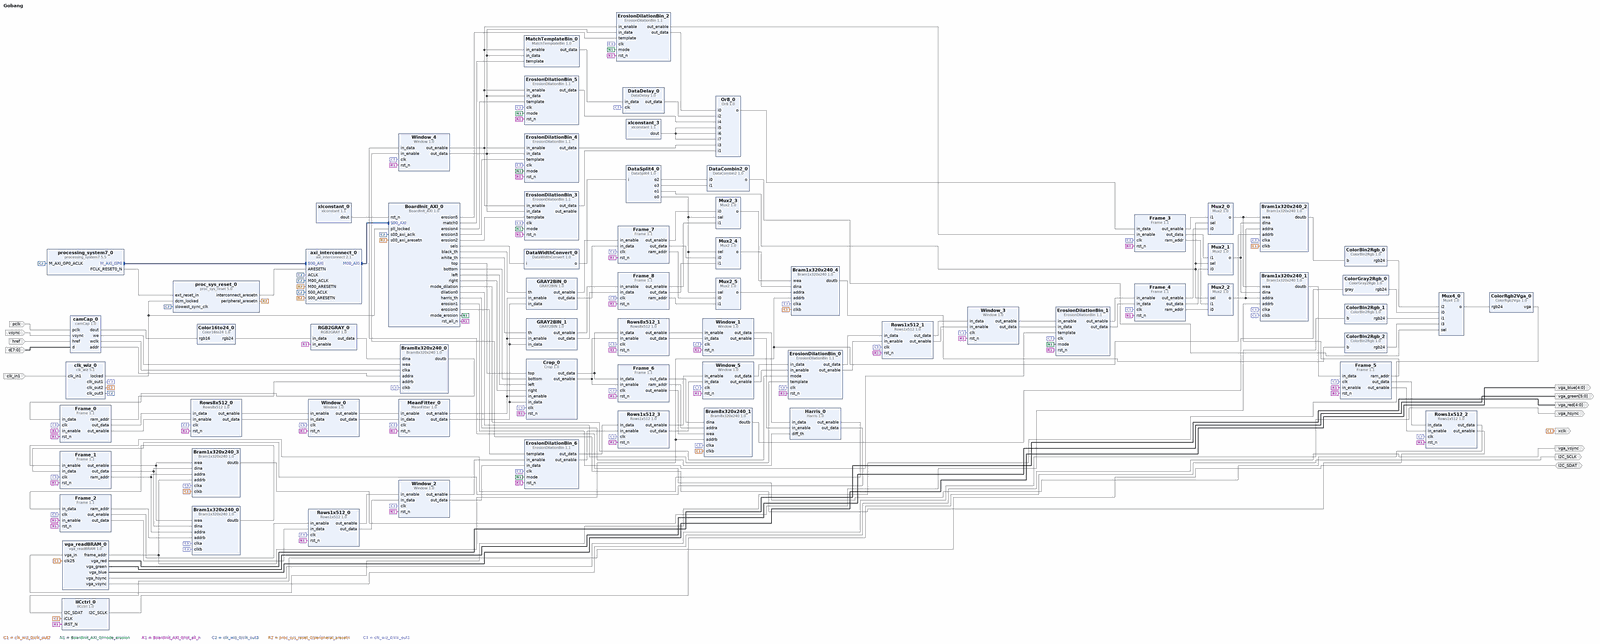
[diagram p0: block diagram of the top level, whole]
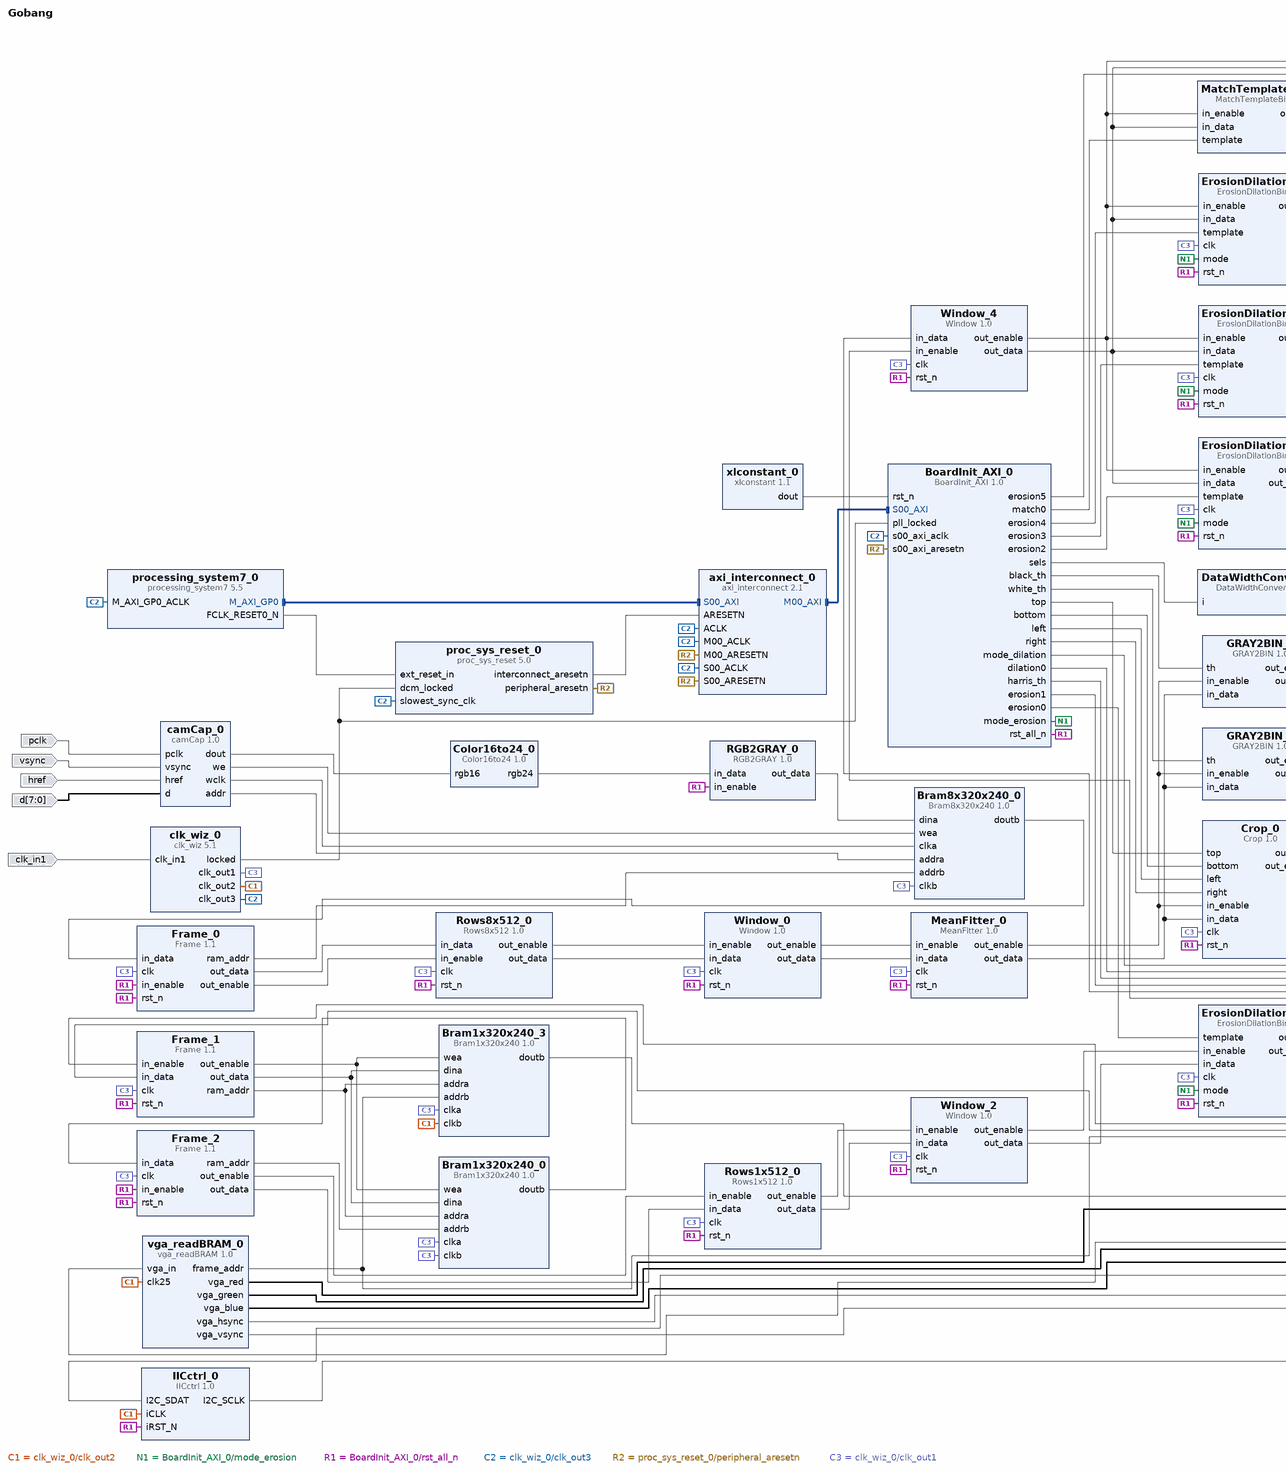
[diagram p1: block diagram of the top level, left part]
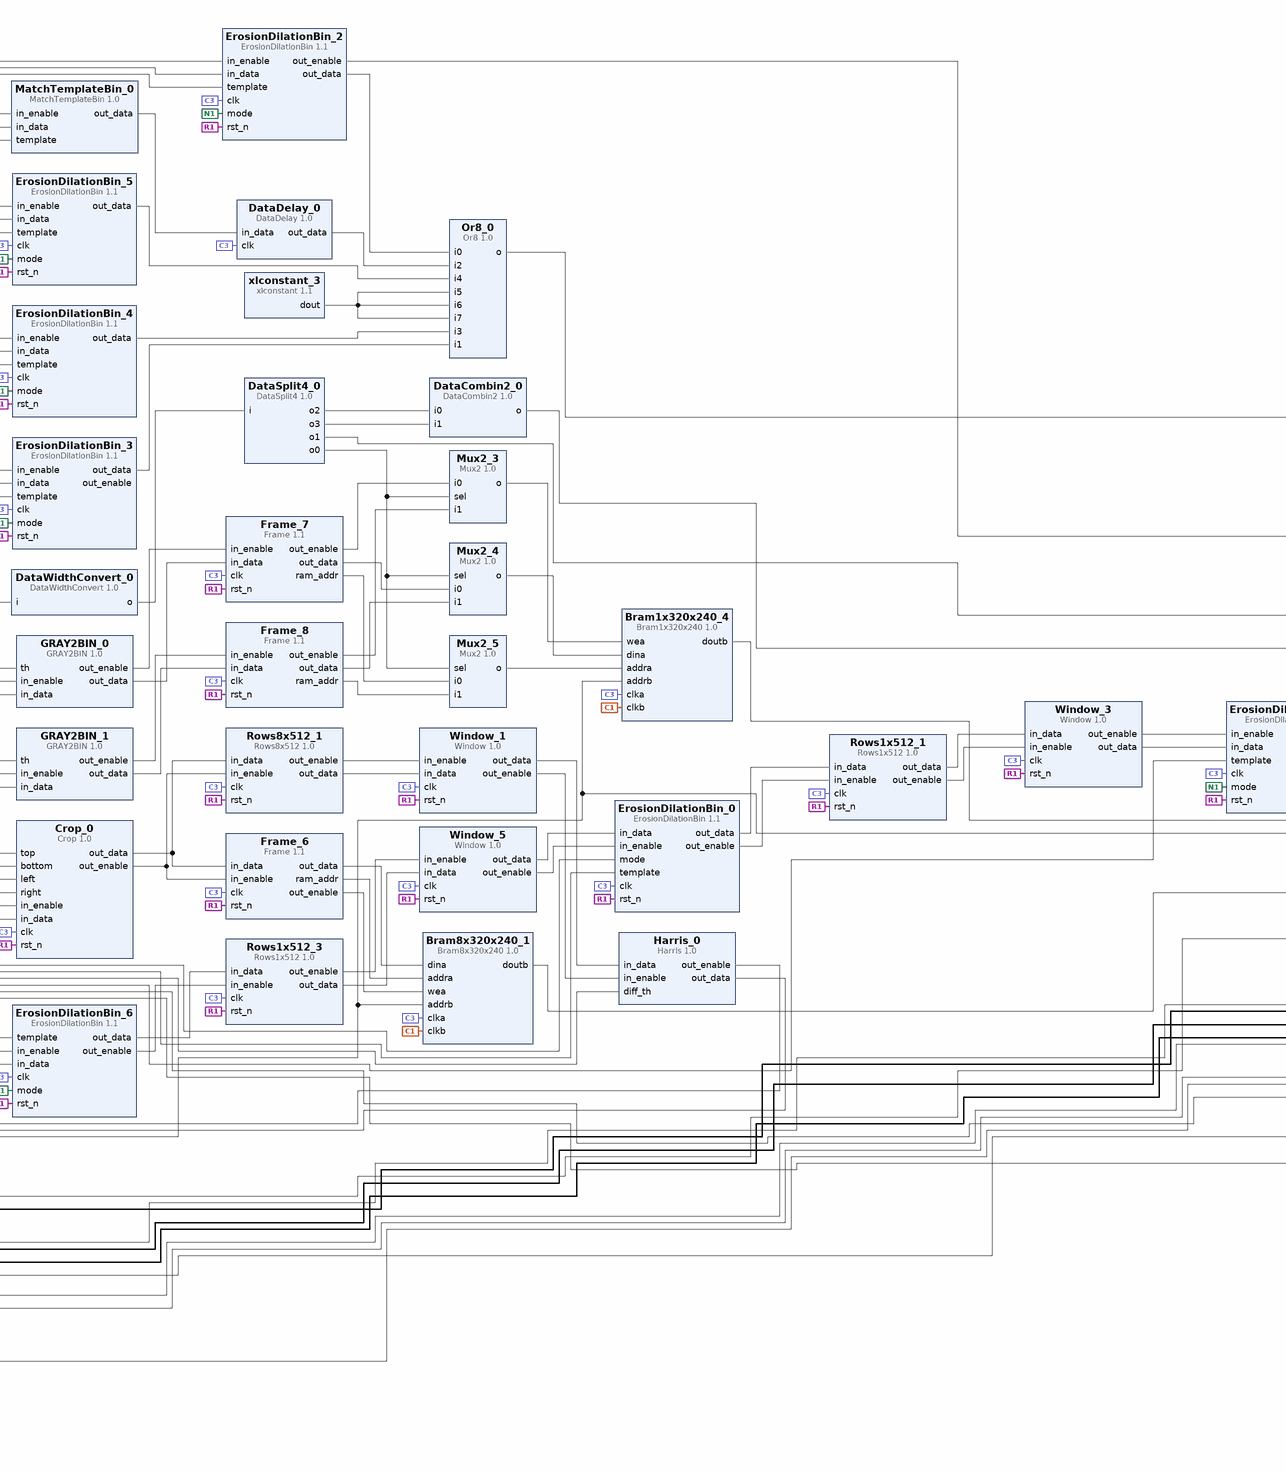
[diagram p2: block diagram of the top level, centre part]
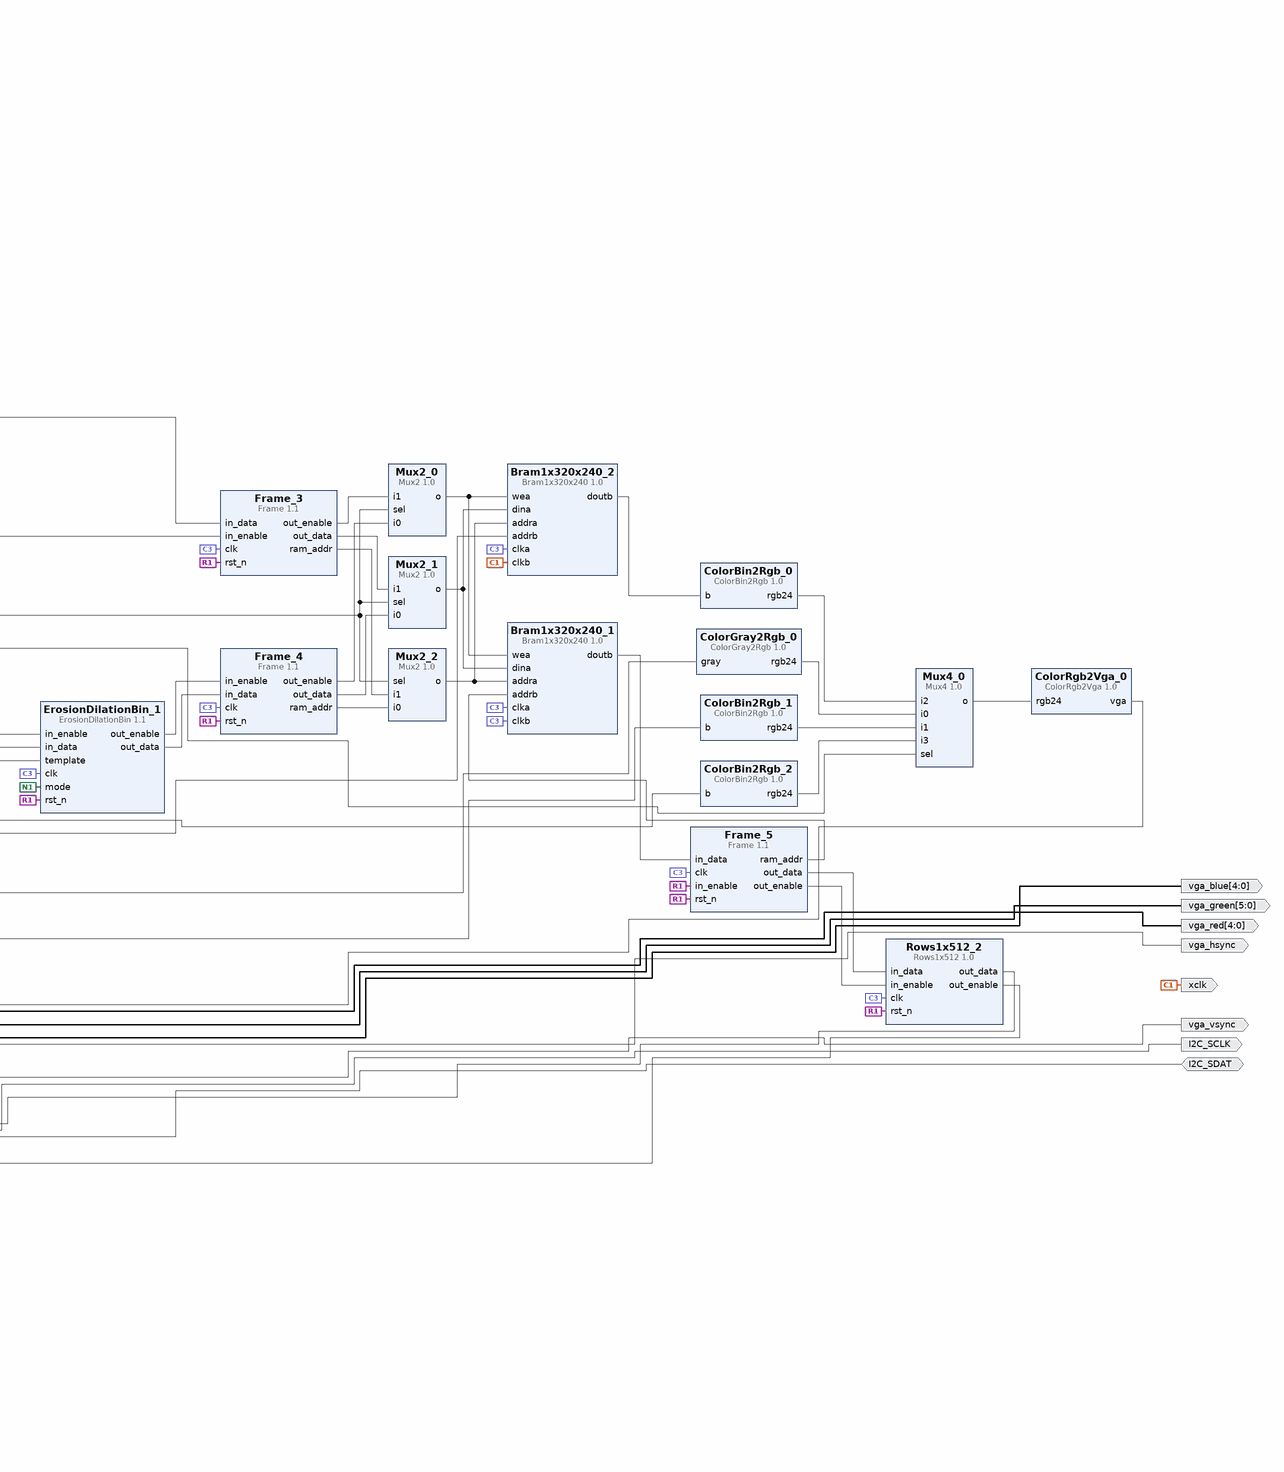
[diagram p3: block diagram of the top level, right part]
# Vivado block design Gobang, Vivado 2014.4
create_bd_design Gobang

create_bd_port -dir O xclk
create_bd_port -dir I pclk
create_bd_port -dir I vsync
create_bd_port -dir I href
create_bd_port -dir I -from 7 -to 0 d
create_bd_port -dir O -from 4 -to 0 vga_red
create_bd_port -dir O -from 5 -to 0 vga_green
create_bd_port -dir O -from 4 -to 0 vga_blue
create_bd_port -dir O vga_hsync
create_bd_port -dir O vga_vsync
create_bd_port -dir O I2C_SCLK
create_bd_port -dir IO I2C_SDAT
create_bd_port -dir I -type clk clk_in1

create_bd_cell -type ip -vlnv xilinx.com:XUP:camCap:1.0 camCap_0
create_bd_cell -type ip -vlnv dtysky:Image:Color16to24:1.0 Color16to24_0
create_bd_cell -type ip -vlnv dtysky:Image:RGB2GRAY:1.0 RGB2GRAY_0
create_bd_cell -type ip -vlnv dtysky:Image:Harris:1.0 Harris_0
create_bd_cell -type ip -vlnv dtysky:Image:MatchTemplateBin:1.0 MatchTemplateBin_0
create_bd_cell -type ip -vlnv xilinx.com:ip:xlconstant:1.1 xlconstant_3
set_property -dict {CONFIG.CONST_VAL 0} [get_bd_cells xlconstant_3]
create_bd_cell -type ip -vlnv dtysky:user:Or8:1.0 Or8_0
create_bd_cell -type ip -vlnv dtysky:Image:ColorBin2Rgb:1.0 ColorBin2Rgb_0
create_bd_cell -type ip -vlnv dtysky:user:Mux2:1.0 Mux2_0
set_property -dict {CONFIG.data_width 1} [get_bd_cells Mux2_0]
create_bd_cell -type ip -vlnv dtysky:user:Mux2:1.0 Mux2_1
set_property -dict {CONFIG.data_width 1} [get_bd_cells Mux2_1]
create_bd_cell -type ip -vlnv dtysky:user:Mux2:1.0 Mux2_2
set_property -dict {CONFIG.data_width 17} [get_bd_cells Mux2_2]
create_bd_cell -type ip -vlnv dtysky:Image:DataDelay:1.0 DataDelay_0
set_property -dict {CONFIG.data_width 1} [get_bd_cells DataDelay_0]
create_bd_cell -type ip -vlnv dtysky:Image:ErosionDilationBin:1.1 ErosionDilationBin_0
set_property -dict {CONFIG.window_size 5 CONFIG.pip_counter 4} [get_bd_cells ErosionDilationBin_0]
create_bd_cell -type ip -vlnv dtysky:Image:ErosionDilationBin:1.1 ErosionDilationBin_1
set_property -dict {CONFIG.window_size 5} [get_bd_cells ErosionDilationBin_1]
create_bd_cell -type ip -vlnv dtysky:Image:ErosionDilationBin:1.1 ErosionDilationBin_2
set_property -dict {CONFIG.window_size 3 CONFIG.pip_counter 3} [get_bd_cells ErosionDilationBin_2]
create_bd_cell -type ip -vlnv dtysky:Image:ErosionDilationBin:1.1 ErosionDilationBin_3
set_property -dict {CONFIG.window_size 3 CONFIG.pip_counter 3} [get_bd_cells ErosionDilationBin_3]
create_bd_cell -type ip -vlnv dtysky:Image:ErosionDilationBin:1.1 ErosionDilationBin_4
set_property -dict {CONFIG.window_size 3 CONFIG.pip_counter 3} [get_bd_cells ErosionDilationBin_4]
create_bd_cell -type ip -vlnv dtysky:Image:ErosionDilationBin:1.1 ErosionDilationBin_5
set_property -dict {CONFIG.window_size 3 CONFIG.pip_counter 3} [get_bd_cells ErosionDilationBin_5]
create_bd_cell -type ip -vlnv dtysky:Image:MeanFitter:1.0 MeanFitter_0
set_property -dict {CONFIG.window_size 5 CONFIG.sum_counter 4} [get_bd_cells MeanFitter_0]
create_bd_cell -type ip -vlnv dtysky:Image:Window:1.0 Window_0
set_property -dict {CONFIG.window_size 5} [get_bd_cells Window_0]
create_bd_cell -type ip -vlnv dtysky:Image:Window:1.0 Window_1
create_bd_cell -type ip -vlnv dtysky:Image:Window:1.0 Window_2
set_property -dict {CONFIG.color_width 1 CONFIG.window_size 3} [get_bd_cells Window_2]
create_bd_cell -type ip -vlnv dtysky:Image:Window:1.0 Window_3
set_property -dict {CONFIG.color_width 1 CONFIG.window_size 5} [get_bd_cells Window_3]
create_bd_cell -type ip -vlnv dtysky:Image:Window:1.0 Window_4
set_property -dict {CONFIG.color_width 1} [get_bd_cells Window_4]
create_bd_cell -type ip -vlnv dtysky:Image:ColorRgb2Vga:1.0 ColorRgb2Vga_0
create_bd_cell -type ip -vlnv xilinx.com:user:vga_readBRAM:1.0 vga_readBRAM_0
create_bd_cell -type ip -vlnv dtysky:Image:Mux4:1.0 Mux4_0
set_property -dict {CONFIG.data_width 24} [get_bd_cells Mux4_0]
create_bd_cell -type ip -vlnv dtysky:Image:ColorGray2Rgb:1.0 ColorGray2Rgb_0
create_bd_cell -type ip -vlnv dtysky:Image:ColorBin2Rgb:1.0 ColorBin2Rgb_1
create_bd_cell -type ip -vlnv xilinx.com:ip:IICctrl:1.0 IICctrl_0
create_bd_cell -type ip -vlnv xilinx.com:ip:Bram1x320x240:1.0 Bram1x320x240_0
create_bd_cell -type ip -vlnv xilinx.com:ip:Bram1x320x240:1.0 Bram1x320x240_1
create_bd_cell -type ip -vlnv xilinx.com:ip:Bram1x320x240:1.0 Bram1x320x240_2
create_bd_cell -type ip -vlnv xilinx.com:ip:Bram1x320x240:1.0 Bram1x320x240_3
create_bd_cell -type ip -vlnv xilinx.com:ip:Bram8x320x240:1.0 Bram8x320x240_0
create_bd_cell -type ip -vlnv xilinx.com:ip:Bram8x320x240:1.0 Bram8x320x240_1
create_bd_cell -type ip -vlnv xilinx.com:ip:clk_wiz:5.1 clk_wiz_0
set_property -dict [list \
  CONFIG.CLKOUT2_USED true \
  CONFIG.CLKOUT3_USED true \
  CONFIG.CLKOUT4_USED true \
  CONFIG.NUM_OUT_CLKS 4 \
  CONFIG.CLKOUT2_REQUESTED_OUT_FREQ 25.000 \
  CONFIG.CLKOUT3_REQUESTED_OUT_FREQ 50 \
  CONFIG.CLKOUT4_REQUESTED_OUT_FREQ 200 \
  CONFIG.USE_LOCKED true \
  CONFIG.USE_RESET false \
  CONFIG.CLKOUT2_JITTER 175.402 \
  CONFIG.CLKOUT2_PHASE_ERROR 98.575 \
  CONFIG.CLKOUT3_JITTER 151.636 \
  CONFIG.CLKOUT3_PHASE_ERROR 98.575 \
  CONFIG.CLKOUT4_JITTER 114.829 \
  CONFIG.CLKOUT4_PHASE_ERROR 98.575 \
] [get_bd_cells clk_wiz_0]
create_bd_cell -type ip -vlnv dtysky:Image:Frame:1.1 Frame_0
set_property -dict {CONFIG.mode 1} [get_bd_cells Frame_0]
create_bd_cell -type ip -vlnv dtysky:Image:Frame:1.1 Frame_1
set_property -dict {CONFIG.color_width 1 CONFIG.row_init 3} [get_bd_cells Frame_1]
create_bd_cell -type ip -vlnv dtysky:Image:Frame:1.1 Frame_2
set_property -dict {CONFIG.mode 1 CONFIG.color_width 1} [get_bd_cells Frame_2]
create_bd_cell -type ip -vlnv dtysky:Image:Frame:1.1 Frame_3
set_property -dict {CONFIG.color_width 1 CONFIG.row_init 1} [get_bd_cells Frame_3]
create_bd_cell -type ip -vlnv dtysky:Image:Frame:1.1 Frame_4
set_property -dict {CONFIG.color_width 1 CONFIG.row_init 5} [get_bd_cells Frame_4]
create_bd_cell -type ip -vlnv dtysky:Image:Frame:1.1 Frame_5
set_property -dict {CONFIG.mode 1 CONFIG.color_width 1} [get_bd_cells Frame_5]
create_bd_cell -type ip -vlnv dtysky:Image:Frame:1.1 Frame_6
set_property -dict {CONFIG.row_init 2} [get_bd_cells Frame_6]
create_bd_cell -type ip -vlnv xilinx.com:ip:processing_system7:5.5 processing_system7_0
set_property -dict [list \
  CONFIG.PCW_CRYSTAL_PERIPHERAL_FREQMHZ 50 \
  CONFIG.PCW_EN_CLK0_PORT 0 \
  CONFIG.PCW_UIPARAM_DDR_ENABLE 0 \
] [get_bd_cells processing_system7_0]
create_bd_cell -type ip -vlnv xilinx.com:ip:proc_sys_reset:5.0 proc_sys_reset_0
create_bd_cell -type ip -vlnv xilinx.com:ip:axi_interconnect:2.1 axi_interconnect_0
set_property -dict {CONFIG.NUM_MI 1} [get_bd_cells axi_interconnect_0]
create_bd_cell -type ip -vlnv dtysky:Image:Crop:1.0 Crop_0
create_bd_cell -type ip -vlnv dtysky:Image:ErosionDilationBin:1.1 ErosionDilationBin_6
set_property -dict {CONFIG.window_size 3 CONFIG.pip_counter 3} [get_bd_cells ErosionDilationBin_6]
create_bd_cell -type ip -vlnv dtysky:Image:Window:1.0 Window_5
set_property -dict {CONFIG.color_width 1 CONFIG.window_size 5} [get_bd_cells Window_5]
create_bd_cell -type ip -vlnv dtysky:Image:Rows1x512:1.0 Rows1x512_0
set_property -dict {CONFIG.rows_width 3} [get_bd_cells Rows1x512_0]
create_bd_cell -type ip -vlnv dtysky:Image:Rows1x512:1.0 Rows1x512_1
create_bd_cell -type ip -vlnv dtysky:Image:Rows1x512:1.0 Rows1x512_2
set_property -dict {CONFIG.rows_width 3} [get_bd_cells Rows1x512_2]
create_bd_cell -type ip -vlnv dtysky:Image:Rows1x512:1.0 Rows1x512_3
set_property -dict {CONFIG.rows_width 5} [get_bd_cells Rows1x512_3]
create_bd_cell -type ip -vlnv dtysky:Image:Rows8x512:1.0 Rows8x512_0
set_property -dict {CONFIG.rows_width 5} [get_bd_cells Rows8x512_0]
create_bd_cell -type ip -vlnv dtysky:Image:Rows8x512:1.0 Rows8x512_1
set_property -dict {CONFIG.rows_width 3} [get_bd_cells Rows8x512_1]
create_bd_cell -type ip -vlnv dtysky:Image:GRAY2BIN:1.0 GRAY2BIN_0
create_bd_cell -type ip -vlnv xilinx.com:ip:xlconstant:1.1 xlconstant_0
create_bd_cell -type ip -vlnv dtysky:Image:GRAY2BIN:1.0 GRAY2BIN_1
create_bd_cell -type ip -vlnv dtysky:Image:Frame:1.1 Frame_7
set_property -dict {CONFIG.row_init 2} [get_bd_cells Frame_7]
create_bd_cell -type ip -vlnv dtysky:Image:Frame:1.1 Frame_8
set_property -dict {CONFIG.row_init 2} [get_bd_cells Frame_8]
create_bd_cell -type ip -vlnv xilinx.com:ip:Bram1x320x240:1.0 Bram1x320x240_4
create_bd_cell -type ip -vlnv dtysky:user:Mux2:1.0 Mux2_3
set_property -dict {CONFIG.data_width 1} [get_bd_cells Mux2_3]
create_bd_cell -type ip -vlnv dtysky:user:Mux2:1.0 Mux2_4
create_bd_cell -type ip -vlnv dtysky:user:Mux2:1.0 Mux2_5
set_property -dict {CONFIG.data_width 17} [get_bd_cells Mux2_5]
create_bd_cell -type ip -vlnv dtysky:Image:ColorBin2Rgb:1.0 ColorBin2Rgb_2
create_bd_cell -type ip -vlnv dtysky:User:DataSplit4:1.0 DataSplit4_0
set_property -dict {CONFIG.data_width 1} [get_bd_cells DataSplit4_0]
create_bd_cell -type ip -vlnv dtysky:User:DataCombin2:1.0 DataCombin2_0
create_bd_cell -type ip -vlnv dtysky:Image:BoardInit_AXI:1.0 BoardInit_AXI_0
create_bd_cell -type ip -vlnv dtysky:User:DataWidthConvert:1.0 DataWidthConvert_0

# ---- connections ----

connect_bd_intf_net [get_bd_intf_pins processing_system7_0/M_AXI_GP0] [get_bd_intf_pins axi_interconnect_0/S00_AXI]
connect_bd_intf_net [get_bd_intf_pins axi_interconnect_0/M00_AXI] [get_bd_intf_pins BoardInit_AXI_0/S00_AXI]
connect_bd_net [get_bd_pins Color16to24_0/rgb24] [get_bd_pins RGB2GRAY_0/in_data]
connect_bd_net [get_bd_pins Rows8x512_0/out_enable] [get_bd_pins Window_0/in_enable]
connect_bd_net [get_bd_pins Rows8x512_0/out_data] [get_bd_pins Window_0/in_data]
connect_bd_net [get_bd_pins Window_0/out_enable] [get_bd_pins MeanFitter_0/in_enable]
connect_bd_net [get_bd_pins Window_0/out_data] [get_bd_pins MeanFitter_0/in_data]
connect_bd_net [get_bd_pins Rows8x512_1/out_enable] [get_bd_pins Window_1/in_enable]
connect_bd_net [get_bd_pins Rows8x512_1/out_data] [get_bd_pins Window_1/in_data]
connect_bd_net [get_bd_pins Window_1/out_data] [get_bd_pins Harris_0/in_data]
connect_bd_net [get_bd_pins Window_1/out_enable] [get_bd_pins Harris_0/in_enable]
connect_bd_net [get_bd_pins Harris_0/out_enable] [get_bd_pins Frame_1/in_enable]
connect_bd_net [get_bd_pins Harris_0/out_data] [get_bd_pins Frame_1/in_data]
connect_bd_net [get_bd_pins camCap_0/we] [get_bd_pins Bram8x320x240_0/wea]
connect_bd_net [get_bd_pins camCap_0/wclk] [get_bd_pins Bram8x320x240_0/clka]
connect_bd_net [get_bd_pins RGB2GRAY_0/out_data] [get_bd_pins Bram8x320x240_0/dina]
connect_bd_net [get_bd_pins camCap_0/addr] [get_bd_pins Bram8x320x240_0/addra]
connect_bd_net [get_bd_pins Bram8x320x240_0/doutb] [get_bd_pins Frame_0/in_data]
connect_bd_net [get_bd_pins Frame_0/ram_addr] [get_bd_pins Bram8x320x240_0/addrb]
connect_bd_net [get_bd_pins Frame_1/out_enable] [get_bd_pins Bram1x320x240_0/wea] [get_bd_pins Bram1x320x240_3/wea]
connect_bd_net [get_bd_pins Frame_1/out_data] [get_bd_pins Bram1x320x240_0/dina] [get_bd_pins Bram1x320x240_3/dina]
connect_bd_net [get_bd_pins Frame_1/ram_addr] [get_bd_pins Bram1x320x240_0/addra] [get_bd_pins Bram1x320x240_3/addra]
connect_bd_net [get_bd_pins Frame_2/ram_addr] [get_bd_pins Bram1x320x240_0/addrb]
connect_bd_net [get_bd_pins Bram1x320x240_0/doutb] [get_bd_pins Frame_2/in_data]
connect_bd_net [get_bd_pins Window_3/out_enable] [get_bd_pins ErosionDilationBin_1/in_enable]
connect_bd_net [get_bd_pins Window_3/out_data] [get_bd_pins ErosionDilationBin_1/in_data]
connect_bd_net [get_bd_pins Bram1x320x240_1/doutb] [get_bd_pins Frame_5/in_data]
connect_bd_net [get_bd_pins Frame_5/ram_addr] [get_bd_pins Bram1x320x240_1/addrb]
connect_bd_net [get_bd_pins Window_4/out_enable] \
  [get_bd_pins MatchTemplateBin_0/in_enable] [get_bd_pins ErosionDilationBin_2/in_enable] \
  [get_bd_pins ErosionDilationBin_3/in_enable] [get_bd_pins ErosionDilationBin_4/in_enable] \
  [get_bd_pins ErosionDilationBin_5/in_enable]
connect_bd_net [get_bd_pins Window_4/out_data] \
  [get_bd_pins MatchTemplateBin_0/in_data] [get_bd_pins ErosionDilationBin_2/in_data] \
  [get_bd_pins ErosionDilationBin_3/in_data] [get_bd_pins ErosionDilationBin_4/in_data] \
  [get_bd_pins ErosionDilationBin_5/in_data]
connect_bd_net [get_bd_pins xlconstant_3/dout] [get_bd_pins Or8_0/i5] [get_bd_pins Or8_0/i6] [get_bd_pins Or8_0/i7]
connect_bd_net [get_bd_pins ErosionDilationBin_2/out_data] [get_bd_pins Or8_0/i0]
connect_bd_net [get_bd_pins ErosionDilationBin_3/out_data] [get_bd_pins Or8_0/i1]
connect_bd_net [get_bd_pins ErosionDilationBin_4/out_data] [get_bd_pins Or8_0/i3]
connect_bd_net [get_bd_pins ErosionDilationBin_5/out_data] [get_bd_pins Or8_0/i4]
connect_bd_net [get_bd_pins Or8_0/o] [get_bd_pins Frame_3/in_data]
connect_bd_net [get_bd_pins ErosionDilationBin_2/out_enable] [get_bd_pins Frame_3/in_enable]
connect_bd_net [get_bd_pins Bram1x320x240_2/doutb] [get_bd_pins ColorBin2Rgb_0/b]
connect_bd_net [get_bd_pins ColorRgb2Vga_0/vga] [get_bd_pins vga_readBRAM_0/vga_in]
connect_bd_net [get_bd_pins vga_readBRAM_0/frame_addr] \
  [get_bd_pins Bram1x320x240_2/addrb] [get_bd_pins Bram1x320x240_3/addrb] [get_bd_pins Bram8x320x240_1/addrb] \
  [get_bd_pins Bram1x320x240_4/addrb]
connect_bd_net [get_bd_pins ErosionDilationBin_1/out_enable] [get_bd_pins Frame_4/in_enable]
connect_bd_net [get_bd_pins ErosionDilationBin_1/out_data] [get_bd_pins Frame_4/in_data]
connect_bd_net [get_bd_pins Frame_4/out_enable] [get_bd_pins Mux2_0/i0]
connect_bd_net [get_bd_pins Frame_4/out_data] [get_bd_pins Mux2_1/i0]
connect_bd_net [get_bd_pins Frame_4/ram_addr] [get_bd_pins Mux2_2/i0]
connect_bd_net [get_bd_pins Frame_3/out_enable] [get_bd_pins Mux2_0/i1]
connect_bd_net [get_bd_pins Frame_3/out_data] [get_bd_pins Mux2_1/i1]
connect_bd_net [get_bd_pins Frame_3/ram_addr] [get_bd_pins Mux2_2/i1]
connect_bd_net [get_bd_pins Mux2_0/o] [get_bd_pins Bram1x320x240_1/wea] [get_bd_pins Bram1x320x240_2/wea]
connect_bd_net [get_bd_pins Mux2_1/o] [get_bd_pins Bram1x320x240_1/dina] [get_bd_pins Bram1x320x240_2/dina]
connect_bd_net [get_bd_pins Mux2_2/o] [get_bd_pins Bram1x320x240_1/addra] [get_bd_pins Bram1x320x240_2/addra]
connect_bd_net [get_bd_pins MatchTemplateBin_0/out_data] [get_bd_pins DataDelay_0/in_data]
connect_bd_net [get_bd_pins DataDelay_0/out_data] [get_bd_pins Or8_0/i2]
connect_bd_net [get_bd_pins clk_wiz_0/clk_out2] \
  [get_bd_ports xclk] [get_bd_pins vga_readBRAM_0/clk25] [get_bd_pins IICctrl_0/iCLK] [get_bd_pins Bram1x320x240_2/clkb] \
  [get_bd_pins Bram1x320x240_3/clkb] [get_bd_pins Bram8x320x240_1/clkb] [get_bd_pins Bram1x320x240_4/clkb]
connect_bd_net -net BoardPreGridInit_0_mode_erosion [get_bd_pins BoardInit_AXI_0/mode_erosion] \
  [get_bd_pins ErosionDilationBin_1/mode] [get_bd_pins ErosionDilationBin_2/mode] [get_bd_pins ErosionDilationBin_3/mode] \
  [get_bd_pins ErosionDilationBin_4/mode] [get_bd_pins ErosionDilationBin_5/mode] [get_bd_pins ErosionDilationBin_6/mode]
connect_bd_net -net sel_1 [get_bd_pins DataSplit4_0/o1] [get_bd_pins Mux2_0/sel] [get_bd_pins Mux2_1/sel] [get_bd_pins Mux2_2/sel]
connect_bd_net [get_bd_ports pclk] [get_bd_pins camCap_0/pclk]
connect_bd_net [get_bd_ports vsync] [get_bd_pins camCap_0/vsync]
connect_bd_net [get_bd_ports href] [get_bd_pins camCap_0/href]
connect_bd_net [get_bd_ports d] [get_bd_pins camCap_0/d]
connect_bd_net [get_bd_pins vga_readBRAM_0/vga_red] [get_bd_ports vga_red]
connect_bd_net [get_bd_pins vga_readBRAM_0/vga_green] [get_bd_ports vga_green]
connect_bd_net [get_bd_pins vga_readBRAM_0/vga_blue] [get_bd_ports vga_blue]
connect_bd_net [get_bd_pins vga_readBRAM_0/vga_hsync] [get_bd_ports vga_hsync]
connect_bd_net [get_bd_pins vga_readBRAM_0/vga_vsync] [get_bd_ports vga_vsync]
connect_bd_net [get_bd_pins Frame_6/out_data] [get_bd_pins Bram8x320x240_1/dina]
connect_bd_net [get_bd_pins Frame_6/ram_addr] [get_bd_pins Bram8x320x240_1/addra]
connect_bd_net [get_bd_pins Frame_6/out_enable] [get_bd_pins Bram8x320x240_1/wea]
connect_bd_net [get_bd_pins Mux4_0/o] [get_bd_pins ColorRgb2Vga_0/rgb24]
connect_bd_net [get_bd_pins Bram8x320x240_1/doutb] [get_bd_pins ColorGray2Rgb_0/gray]
connect_bd_net [get_bd_pins Bram1x320x240_3/doutb] [get_bd_pins ColorBin2Rgb_1/b]
connect_bd_net [get_bd_pins camCap_0/dout] [get_bd_pins Color16to24_0/rgb16]
# net out_enable has one end: ErosionDilationBin_3/out_enable
connect_bd_net [get_bd_pins IICctrl_0/I2C_SCLK] [get_bd_ports I2C_SCLK]
connect_bd_net [get_bd_ports I2C_SDAT] [get_bd_pins IICctrl_0/I2C_SDAT]
connect_bd_net [get_bd_pins ErosionDilationBin_0/out_data] [get_bd_pins Rows1x512_1/in_data]
connect_bd_net [get_bd_pins ErosionDilationBin_0/out_enable] [get_bd_pins Rows1x512_1/in_enable]
connect_bd_net [get_bd_pins Rows1x512_1/out_data] [get_bd_pins Window_3/in_data]
connect_bd_net [get_bd_pins Rows1x512_1/out_enable] [get_bd_pins Window_3/in_enable]
connect_bd_net [get_bd_pins Frame_5/out_data] [get_bd_pins Rows1x512_2/in_data]
connect_bd_net [get_bd_pins Frame_5/out_enable] [get_bd_pins Rows1x512_2/in_enable]
connect_bd_net [get_bd_pins Rows1x512_2/out_data] [get_bd_pins Window_4/in_data]
connect_bd_net [get_bd_pins Rows1x512_2/out_enable] [get_bd_pins Window_4/in_enable]
connect_bd_net [get_bd_pins Frame_2/out_enable] [get_bd_pins Rows1x512_0/in_enable]
connect_bd_net [get_bd_pins Frame_2/out_data] [get_bd_pins Rows1x512_0/in_data]
connect_bd_net [get_bd_pins Rows1x512_0/out_enable] [get_bd_pins Window_2/in_enable]
connect_bd_net [get_bd_pins Rows1x512_0/out_data] [get_bd_pins Window_2/in_data]
connect_bd_net -net clk_in1_1 [get_bd_ports clk_in1] [get_bd_pins clk_wiz_0/clk_in1]
connect_bd_net [get_bd_pins clk_wiz_0/locked] [get_bd_pins proc_sys_reset_0/dcm_locked] [get_bd_pins BoardInit_AXI_0/pll_locked]
connect_bd_net [get_bd_pins BoardInit_AXI_0/mode_dilation] [get_bd_pins ErosionDilationBin_0/mode]
connect_bd_net [get_bd_pins BoardInit_AXI_0/dilation0] [get_bd_pins ErosionDilationBin_0/template]
connect_bd_net [get_bd_pins BoardInit_AXI_0/erosion2] [get_bd_pins ErosionDilationBin_3/template]
connect_bd_net [get_bd_pins BoardInit_AXI_0/erosion3] [get_bd_pins ErosionDilationBin_4/template]
connect_bd_net [get_bd_pins BoardInit_AXI_0/erosion4] [get_bd_pins ErosionDilationBin_5/template]
connect_bd_net [get_bd_pins BoardInit_AXI_0/match0] [get_bd_pins MatchTemplateBin_0/template]
connect_bd_net [get_bd_pins BoardInit_AXI_0/harris_th] [get_bd_pins Harris_0/diff_th]
connect_bd_net [get_bd_pins BoardInit_AXI_0/rst_all_n] \
  [get_bd_pins ErosionDilationBin_0/rst_n] [get_bd_pins ErosionDilationBin_1/rst_n] [get_bd_pins ErosionDilationBin_2/rst_n] \
  [get_bd_pins ErosionDilationBin_3/rst_n] [get_bd_pins ErosionDilationBin_4/rst_n] [get_bd_pins Frame_0/in_enable] \
  [get_bd_pins Frame_0/rst_n] [get_bd_pins ErosionDilationBin_5/rst_n] [get_bd_pins Frame_1/rst_n] \
  [get_bd_pins Frame_2/in_enable] [get_bd_pins Frame_2/rst_n] [get_bd_pins Frame_3/rst_n] [get_bd_pins Frame_4/rst_n] \
  [get_bd_pins Frame_5/in_enable] [get_bd_pins Frame_5/rst_n] [get_bd_pins Frame_6/rst_n] [get_bd_pins IICctrl_0/iRST_N] \
  [get_bd_pins MeanFitter_0/rst_n] [get_bd_pins RGB2GRAY_0/in_enable] [get_bd_pins Window_0/rst_n] \
  [get_bd_pins Window_1/rst_n] [get_bd_pins Window_2/rst_n] [get_bd_pins Window_3/rst_n] [get_bd_pins Window_4/rst_n] \
  [get_bd_pins Crop_0/rst_n] [get_bd_pins Window_5/rst_n] [get_bd_pins ErosionDilationBin_6/rst_n] \
  [get_bd_pins Rows1x512_0/rst_n] [get_bd_pins Rows1x512_1/rst_n] [get_bd_pins Rows1x512_2/rst_n] \
  [get_bd_pins Rows1x512_3/rst_n] [get_bd_pins Rows8x512_0/rst_n] [get_bd_pins Rows8x512_1/rst_n] [get_bd_pins Frame_8/rst_n] \
  [get_bd_pins Frame_7/rst_n]
connect_bd_net [get_bd_pins clk_wiz_0/clk_out3] \
  [get_bd_pins processing_system7_0/M_AXI_GP0_ACLK] [get_bd_pins proc_sys_reset_0/slowest_sync_clk] \
  [get_bd_pins axi_interconnect_0/ACLK] [get_bd_pins axi_interconnect_0/S00_ACLK] [get_bd_pins axi_interconnect_0/M00_ACLK] \
  [get_bd_pins BoardInit_AXI_0/s00_axi_aclk]
connect_bd_net [get_bd_pins processing_system7_0/FCLK_RESET0_N] [get_bd_pins proc_sys_reset_0/ext_reset_in]
connect_bd_net [get_bd_pins proc_sys_reset_0/interconnect_aresetn] [get_bd_pins axi_interconnect_0/ARESETN]
connect_bd_net [get_bd_pins proc_sys_reset_0/peripheral_aresetn] \
  [get_bd_pins axi_interconnect_0/S00_ARESETN] [get_bd_pins axi_interconnect_0/M00_ARESETN] \
  [get_bd_pins BoardInit_AXI_0/s00_axi_aresetn]
connect_bd_net [get_bd_pins clk_wiz_0/clk_out1] \
  [get_bd_pins Bram1x320x240_0/clka] [get_bd_pins Bram1x320x240_0/clkb] [get_bd_pins Bram1x320x240_1/clka] \
  [get_bd_pins Bram1x320x240_1/clkb] [get_bd_pins Bram1x320x240_2/clka] [get_bd_pins Bram1x320x240_3/clka] \
  [get_bd_pins Bram8x320x240_0/clkb] [get_bd_pins Bram8x320x240_1/clka] [get_bd_pins DataDelay_0/clk] \
  [get_bd_pins ErosionDilationBin_0/clk] [get_bd_pins ErosionDilationBin_1/clk] [get_bd_pins ErosionDilationBin_2/clk] \
  [get_bd_pins ErosionDilationBin_3/clk] [get_bd_pins ErosionDilationBin_4/clk] [get_bd_pins ErosionDilationBin_5/clk] \
  [get_bd_pins Frame_0/clk] [get_bd_pins Frame_1/clk] [get_bd_pins Frame_2/clk] [get_bd_pins Frame_3/clk] \
  [get_bd_pins Frame_4/clk] [get_bd_pins Frame_5/clk] [get_bd_pins Frame_6/clk] [get_bd_pins MeanFitter_0/clk] \
  [get_bd_pins Window_0/clk] [get_bd_pins Window_1/clk] [get_bd_pins Window_2/clk] [get_bd_pins Window_3/clk] \
  [get_bd_pins Window_4/clk] [get_bd_pins Crop_0/clk] [get_bd_pins ErosionDilationBin_6/clk] [get_bd_pins Window_5/clk] \
  [get_bd_pins Rows1x512_0/clk] [get_bd_pins Rows1x512_1/clk] [get_bd_pins Rows1x512_2/clk] [get_bd_pins Rows1x512_3/clk] \
  [get_bd_pins Rows8x512_0/clk] [get_bd_pins Rows8x512_1/clk] [get_bd_pins Bram1x320x240_4/clka] [get_bd_pins Frame_7/clk] \
  [get_bd_pins Frame_8/clk]
connect_bd_net [get_bd_pins MeanFitter_0/out_enable] \
  [get_bd_pins Crop_0/in_enable] [get_bd_pins GRAY2BIN_0/in_enable] [get_bd_pins GRAY2BIN_1/in_enable]
connect_bd_net [get_bd_pins MeanFitter_0/out_data] [get_bd_pins Crop_0/in_data] [get_bd_pins GRAY2BIN_0/in_data] [get_bd_pins GRAY2BIN_1/in_data]
connect_bd_net [get_bd_pins Crop_0/out_data] [get_bd_pins Frame_6/in_data] [get_bd_pins Rows8x512_1/in_data]
connect_bd_net [get_bd_pins Crop_0/out_enable] [get_bd_pins Frame_6/in_enable] [get_bd_pins Rows8x512_1/in_enable]
connect_bd_net [get_bd_pins BoardInit_AXI_0/top] [get_bd_pins Crop_0/top]
connect_bd_net [get_bd_pins BoardInit_AXI_0/bottom] [get_bd_pins Crop_0/bottom]
connect_bd_net [get_bd_pins BoardInit_AXI_0/left] [get_bd_pins Crop_0/left]
connect_bd_net [get_bd_pins BoardInit_AXI_0/right] [get_bd_pins Crop_0/right]
connect_bd_net [get_bd_pins Window_2/out_enable] [get_bd_pins ErosionDilationBin_6/in_enable]
connect_bd_net [get_bd_pins Window_2/out_data] [get_bd_pins ErosionDilationBin_6/in_data]
connect_bd_net [get_bd_pins Rows1x512_3/out_enable] [get_bd_pins Window_5/in_enable]
connect_bd_net [get_bd_pins Rows1x512_3/out_data] [get_bd_pins Window_5/in_data]
connect_bd_net [get_bd_pins Window_5/out_data] [get_bd_pins ErosionDilationBin_0/in_data]
connect_bd_net [get_bd_pins Window_5/out_enable] [get_bd_pins ErosionDilationBin_0/in_enable]
connect_bd_net [get_bd_pins ColorGray2Rgb_0/rgb24] [get_bd_pins Mux4_0/i0]
connect_bd_net [get_bd_pins BoardInit_AXI_0/erosion5] [get_bd_pins ErosionDilationBin_2/template]
connect_bd_net [get_bd_pins BoardInit_AXI_0/erosion0] [get_bd_pins ErosionDilationBin_6/template]
connect_bd_net [get_bd_pins BoardInit_AXI_0/erosion1] [get_bd_pins ErosionDilationBin_1/template]
connect_bd_net [get_bd_pins ErosionDilationBin_6/out_data] [get_bd_pins Rows1x512_3/in_data]
connect_bd_net [get_bd_pins ErosionDilationBin_6/out_enable] [get_bd_pins Rows1x512_3/in_enable]
connect_bd_net [get_bd_pins xlconstant_0/dout] [get_bd_pins BoardInit_AXI_0/rst_n]
connect_bd_net [get_bd_pins GRAY2BIN_0/out_enable] [get_bd_pins Frame_7/in_enable]
connect_bd_net [get_bd_pins GRAY2BIN_0/out_data] [get_bd_pins Frame_7/in_data]
connect_bd_net [get_bd_pins GRAY2BIN_1/out_enable] [get_bd_pins Frame_8/in_enable]
connect_bd_net [get_bd_pins GRAY2BIN_1/out_data] [get_bd_pins Frame_8/in_data]
connect_bd_net [get_bd_pins Frame_7/out_enable] [get_bd_pins Mux2_3/i0]
connect_bd_net [get_bd_pins Frame_8/out_enable] [get_bd_pins Mux2_3/i1]
connect_bd_net [get_bd_pins Frame_7/out_data] [get_bd_pins Mux2_4/i0]
connect_bd_net [get_bd_pins Frame_8/out_data] [get_bd_pins Mux2_4/i1]
connect_bd_net [get_bd_pins Frame_7/ram_addr] [get_bd_pins Mux2_5/i0]
connect_bd_net [get_bd_pins Frame_8/ram_addr] [get_bd_pins Mux2_5/i1]
connect_bd_net [get_bd_pins Mux2_3/o] [get_bd_pins Bram1x320x240_4/wea]
connect_bd_net [get_bd_pins Mux2_4/o] [get_bd_pins Bram1x320x240_4/dina]
connect_bd_net [get_bd_pins Mux2_5/o] [get_bd_pins Bram1x320x240_4/addra]
connect_bd_net [get_bd_pins Bram1x320x240_4/doutb] [get_bd_pins ColorBin2Rgb_2/b]
connect_bd_net [get_bd_pins ColorBin2Rgb_0/rgb24] [get_bd_pins Mux4_0/i2]
connect_bd_net [get_bd_pins ColorBin2Rgb_1/rgb24] [get_bd_pins Mux4_0/i1]
connect_bd_net [get_bd_pins ColorBin2Rgb_2/rgb24] [get_bd_pins Mux4_0/i3]
connect_bd_net [get_bd_pins BoardInit_AXI_0/black_th] [get_bd_pins GRAY2BIN_0/th]
connect_bd_net [get_bd_pins BoardInit_AXI_0/white_th] [get_bd_pins GRAY2BIN_1/th]
connect_bd_net -net sel_2 [get_bd_pins DataSplit4_0/o0] [get_bd_pins Mux2_3/sel] [get_bd_pins Mux2_4/sel] [get_bd_pins Mux2_5/sel]
connect_bd_net [get_bd_pins Frame_0/out_data] [get_bd_pins Rows8x512_0/in_data]
connect_bd_net [get_bd_pins Frame_0/out_enable] [get_bd_pins Rows8x512_0/in_enable]
connect_bd_net [get_bd_pins DataSplit4_0/o2] [get_bd_pins DataCombin2_0/i0]
connect_bd_net [get_bd_pins DataSplit4_0/o3] [get_bd_pins DataCombin2_0/i1]
connect_bd_net [get_bd_pins DataCombin2_0/o] [get_bd_pins Mux4_0/sel]
connect_bd_net [get_bd_pins DataWidthConvert_0/o] [get_bd_pins DataSplit4_0/i]
connect_bd_net [get_bd_pins BoardInit_AXI_0/sels] [get_bd_pins DataWidthConvert_0/i]

# ---- address map ----
assign_bd_address -offset 0x43C00000 -range 64K -target_address_space [get_bd_addr_spaces processing_system7_0/Data] [get_bd_addr_segs BoardInit_AXI_0/S00_AXI/S00_AXI_reg]

validate_bd_design
save_bd_design
